# Altium schematic sheet USB_Programmer.SchDoc
size A4; SheetNumber: 4; SheetTotal: 13
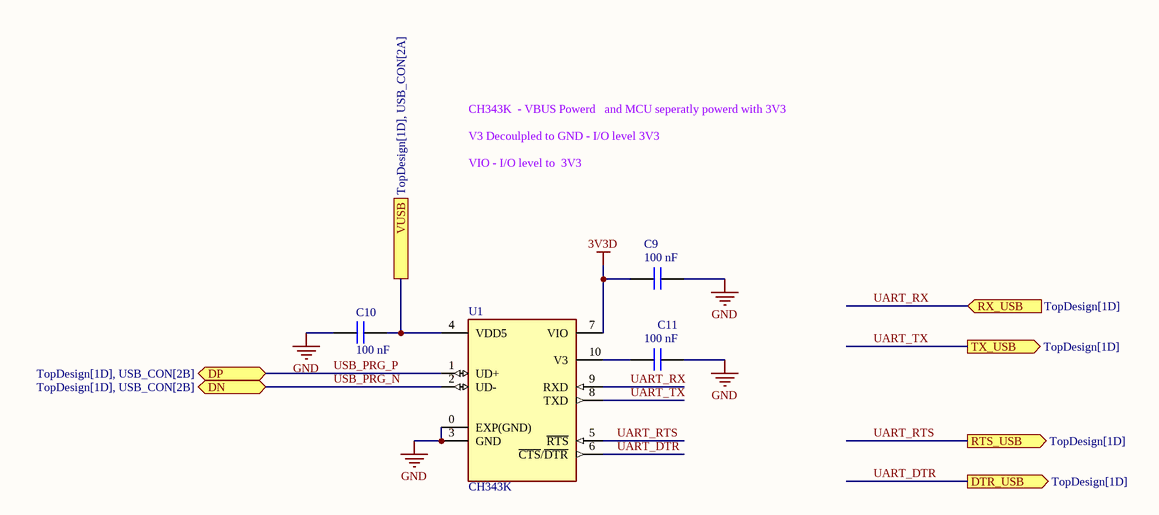
[diagram p0: USB_Programmer.SchDoc]

## Parts
C9  100 nF  [CAP_0603]
C10  100 nF  [CAP_0603]
C11  100 nF  [CAP_0603]
U1  CH343K  [CH343K]

## Ports
DN (bidir, see TopDesign[1D], USB_CON[2B]), DP (bidir, see TopDesign[1D], USB_CON[2B]), DTR_USB (out, see TopDesign[1D]), RTS_USB (out, see TopDesign[1D]), RX_USB (in, see TopDesign[1D]), TX_USB (out, see TopDesign[1D]), VUSB (see TopDesign[1D], USB_CON[2A])

## Nets
3V3D: C9.2 U1.7(VIO)
GND: C9.1 C10.2 C11.1 U1.0(EXP(GND)) U1.3(GND)
UART_DTR: U1.6(~{CTS}/~{DTR}) ; port DTR_USB
UART_RTS: U1.5(~{RTS}) ; port RTS_USB
UART_RX: U1.9(RXD) ; port RX_USB
UART_TX: U1.8(TXD) ; port TX_USB
USB_PRG_N: U1.2(UD-) ; port DN
USB_PRG_P: U1.1(UD+) ; port DP
VUSB: C10.1 U1.4(VDD5) ; port VUSB
NetC11_2: C11.2 U1.10(V3)

## Notes on the sheet
- CH343K  - VBUS Powerd   and MCU seperatly powerd with 3V3
- V3 Decoulpled to GND - I/O level 3V3
- VIO - I/O level to  3V3

## Library data of the parts
C9-C11 = Cap SMD: Cap SMD.
U1 = CH343K: USB to UART USB 2.0 ESSOP-10-150mil-1mm Interface Controllers ROHS; MF: WCH; Package: ESSOP-10; Datasheet: https://www.lcsc.com/datasheet/C5832295.pdf; MP: CH343K; Check_prices: https://www.lcsc.com/product-detail/C5832295.html?s_z=n_CH343; LCSC: C5832295